# EAGLE design Power_Opamp (EAGLE 9.6.2)
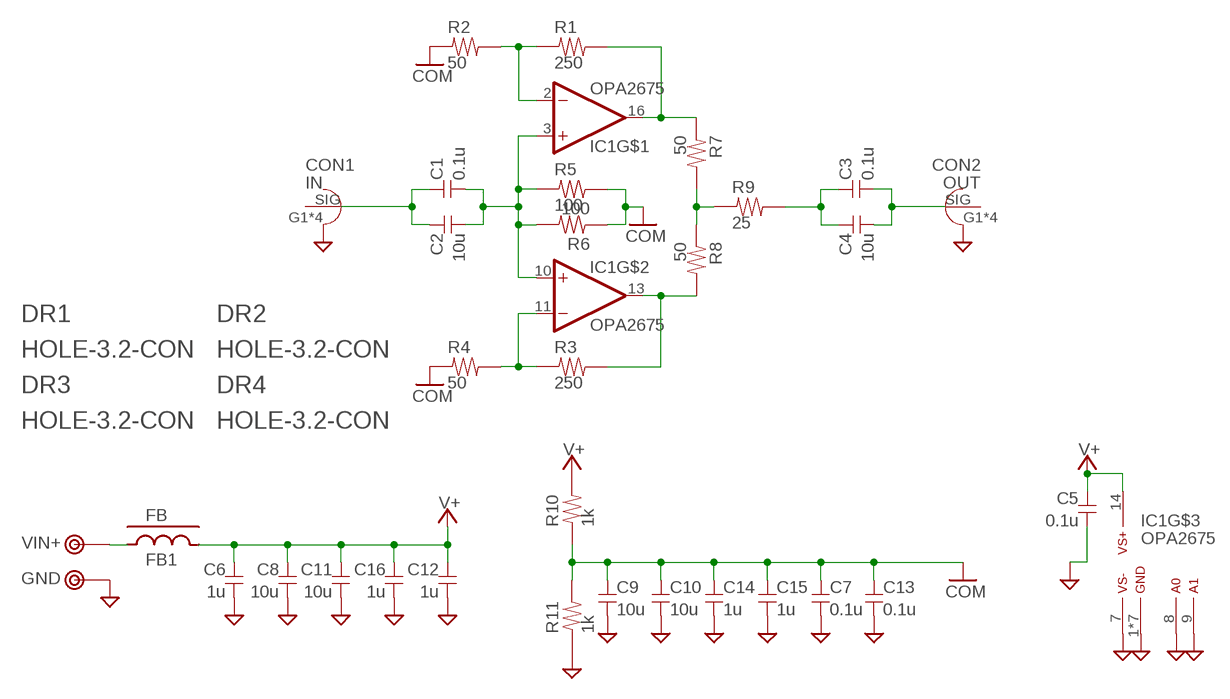
[diagram p0: schematic, sheet 1]

## Parts
C1  0.1u  C-1608  [1608C]
C2  10u  C-2012  [2012]
C3  0.1u  C-1608  [1608C]
C4  10u  C-2012  [2012]
C5  0.1u  C-1005  [1005]
C6  1u  C-1608  [1608C]
C7  0.1u  C-1005  [1005]
C8  10u  C-3216  [3216]
C9  10u  C-3216  [3216]
C10  10u  C-2012  [2012]
C11  10u  C-2012  [2012]
C12  1u  C-1608  [1608C]
C13  0.1u  C-1005  [1005]
C14  1u  C-1608  [1608C]
C15  1u  C-1608  [1608C]
C16  1u  C-1608  [1608C]
CON1  IN  SMA-142-0701-801  [SMA-EDGE]
CON2  OUT  SMA-142-0701-801  [SMA-EDGE]
DR1  HOLE-3.2-CON  [HOLE_3.2_CON]
DR2  HOLE-3.2-CON  [HOLE_3.2_CON]
DR3  HOLE-3.2-CON  [HOLE_3.2_CON]
DR4  HOLE-3.2-CON  [HOLE_3.2_CON]
FB1  FB  FB-2012  [2012-J]
IC1  OPA2675  [VQFN16]
R1  250  R-1608-3  [1608-3]
R2  50  R-1608-3  [1608-3]
R3  250  R-1608-3  [1608-3]
R4  50  R-1608-3  [1608-3]
R5  100  R-1608-3  [1608-3]
R6  100  R-1608-3  [1608-3]
R7  50  R-1608  [1608]
R8  50  R-1608  [1608]
R9  25  R-1608  [1608]
R10  1k  R-1608  [1608]
R11  1k  R-1608  [1608]
TP1  VIN+  TESTPIN-BIG  [TESTPIN-BIG]
TP2  GND  TESTPIN-BIG  [TESTPIN-BIG]

## Nets
AMP_IN: C1.2 C2.2 IC1.3(+IN) IC1.10(+IN) R5.1 R6.2
AMP_OUT: C3.1 C4.1 R9.2
COM: C7.1 C9.1 C10.1 C13.1 C14.1 C15.1 R2.1 R4.1 R5.2 R6.1 R10.1 R11.2
GND: C5.2 C6.2 C7.2 C8.2 C9.2 C10.2 C11.2 C12.2 C13.2 C14.2 C15.2 C16.2 CON1.G1(GND) CON1.G2(GND) CON1.G3(GND) CON1.G4(GND) CON2.G1(GND) CON2.G2(GND) CON2.G3(GND) CON2.G4(GND) IC1.1(GND) IC1.4(GND) IC1.5(GND) IC1.6(GND) IC1.7(VS-) IC1.8(A0) IC1.9(A1) IC1.12(GND) IC1.15(GND) IC1.HT(GND) R11.1 TP2.1
N$1: IC1.11(-IN) R3.1 R4.2
N$2: IC1.2(-IN) R1.1 R2.2
N$3: IC1.13(OUT) R3.2 R8.2
N$4: IC1.16(OUT) R1.2 R7.1
N$7: C1.1 C2.1 CON1.SIG
N$8: C3.2 C4.2 CON2.SIG
N$9: R7.2 R8.1 R9.1
N$10: FB1.2 TP1.1
V+: C5.1 C6.1 C8.1 C11.1 C12.1 C16.1 FB1.1 IC1.14(VS+) R10.2

## Library data of the parts
C1-C16 = my_rcl:C
CON1 CON2 = my_connector:SMA
DR1-DR4 = my_connector:HOLE-3.2
FB1 = my_rcl:FB
IC1 = my_ic:OPA2675
R1-R11 = my_rcl:R
TP1 TP2 = my_connector:TESTPIN

## Board
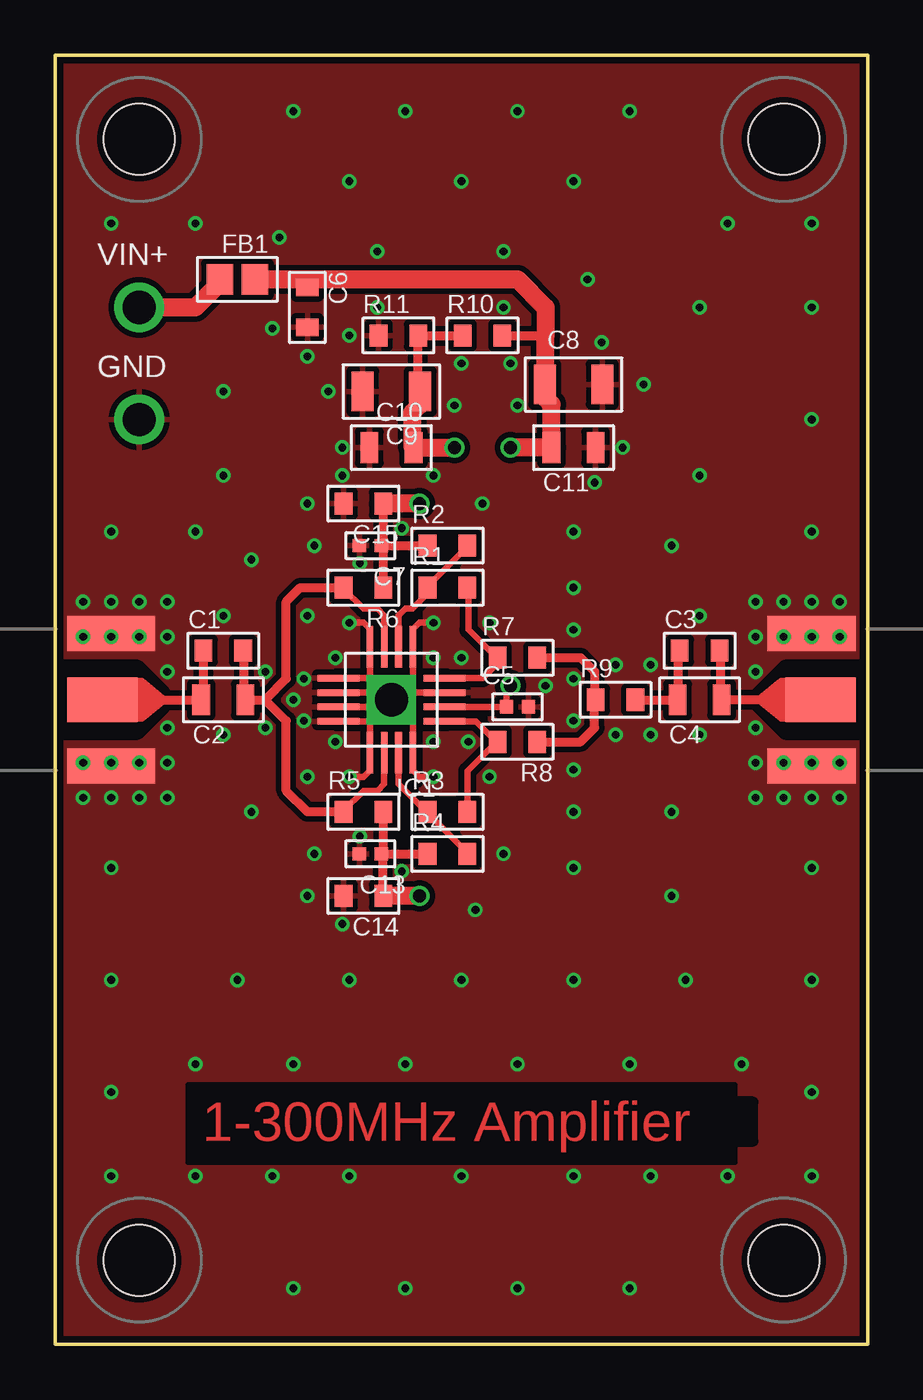
[diagram p1: board, top side]
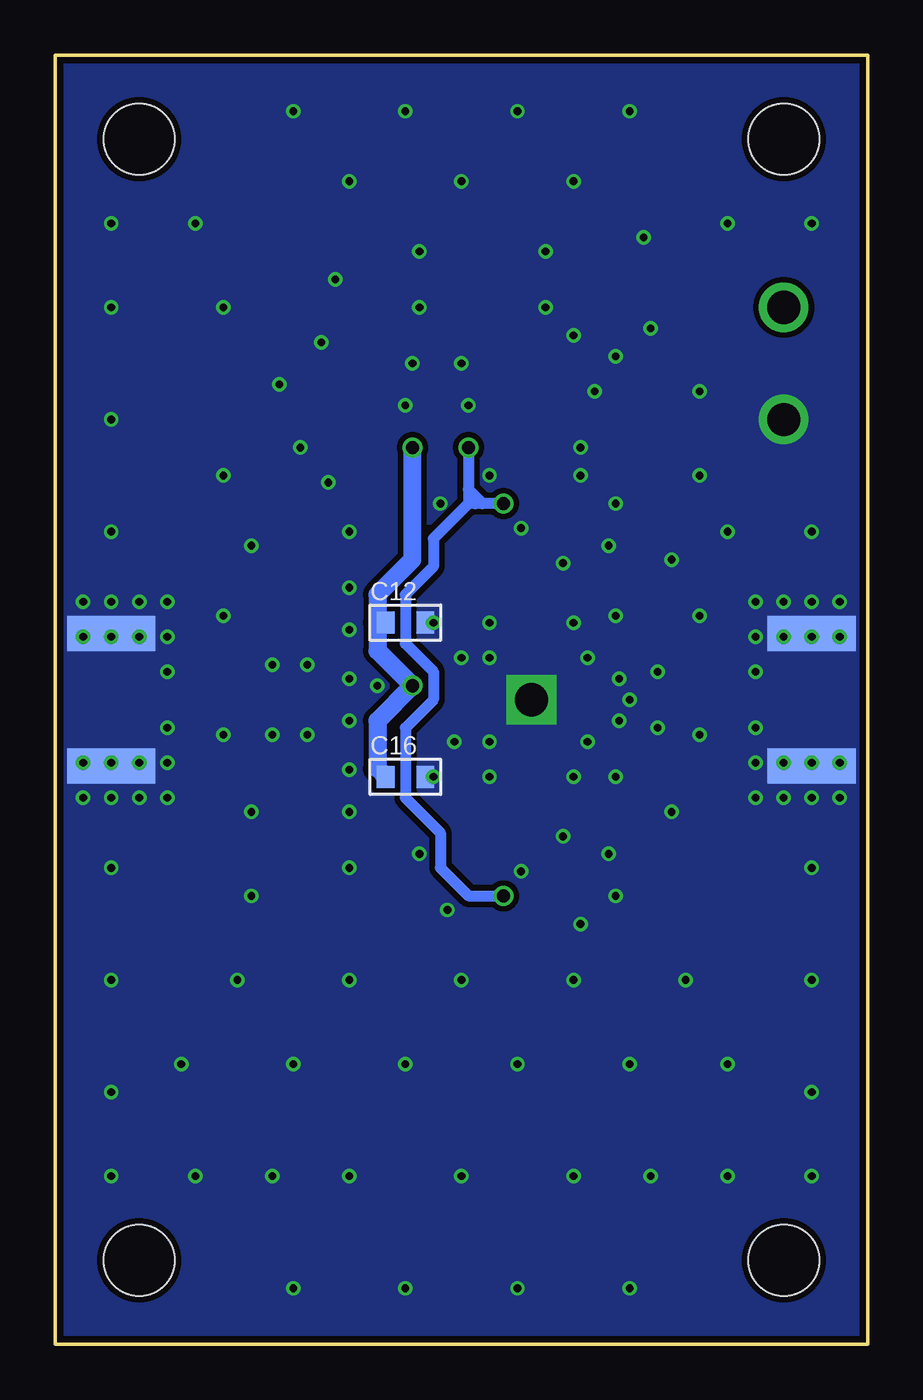
[diagram p2: board, bottom side, seen from below]

Size 36.83 x 58.42 mm. Coordinates in mm from the lower left corner, seen from the top.
Outline: 0,0 36.83,0 36.83,58.42 0,58.42 0,0
Copper layers (1*16): Top 0.035mm / dielectric 1.5mm / Bottom 0.035mm
Design rules "SeeedStudio_2layer_DRU_20140221": minimum track width 6mil, minimum drill 0.3mm, track to track 8mil, track to pad 8mil, pad to pad 8mil, via to via 12mil, smd to smd 0mil, copper to edge 0.3mm, drill to drill 10mil, minimum pad ring 0.15mm, minimum via ring 6mil, stop-mask expansion 2mil, vias tented up to drill 1mm, thermal gap 10mil

### Footprints (pad centres in the part's own frame; a part is rotated, then mirrored left to right if it is on the bottom)
1608C = smd 0.8 x 1: 1 -0.9,0; 2 0.9,0
2012 = smd 0.8 x 1.4: 1 -1,0; 2 1,0
1005 = smd 0.6 x 0.6: 1 -0.5,0; 2 0.5,0
3216 = smd 1 x 1.8: 1 -1.3,0; 2 1.3,0
SMA-EDGE = smd 1.6 x 4: G1 -3,0; G2 3,0 | smd 1.6 x 4 bottom: G3 -3,0; G4 3,0 | smd 2 x 3.2: SIG 0,0.4
HOLE_3.2_CON = hole 3.2: 0,0
2012-J = smd 1.2 x 1.4: 1 -0.8,0; 2 0.8,0
VQFN16 = smd 0.3 x 1.9: 1 -0.975,-2.4; 2 -0.325,-2.4; 3 0.325,-2.4; 4 0.975,-2.4; 9 0.975,2.4; 10 0.325,2.4; 11 -0.325,2.4; 12 -0.975,2.4 | smd 1.9 x 0.3: 5 2.4,-0.975; 6 2.4,-0.325; 7 2.4,0.325; 8 2.4,0.975; 13 -2.4,0.975; 14 -2.4,0.325; 15 -2.4,-0.325; 16 -2.4,-0.975 | drill 1.5 pad 2.2 square: HT 0,0
1608-3 = smd 0.8 x 1: 1 -0.9,0; 2 0.9,0
1608 = smd 0.8 x 1: 1 -0.9,0; 2 0.9,0
TESTPIN-BIG = drill 1.5: 1 0,0

### Placement (x,y rotation side)
C1  7.62,31.43 0 top
C2  7.62,29.21 0 top
C3  29.21,31.43 0 top
C4  29.21,29.21 0 top
C5  20.95,28.89 0 top
C6  11.43,46.99 270 top
C7  14.29,36.2 180 top
C8  23.5,43.5 0 top
C9  15.24,43.18 180 top
C10  15.24,40.64 180 top
C11  23.5,40.64 0 top
C12  20.95,32.7 0 bottom
C13  14.29,22.23 180 top
C14  13.97,20.32 180 top
C15  13.97,38.1 180 top
C16  20.95,25.72 0 bottom
CON1  2.54,29.21 90 top
CON2  34.29,29.21 270 top
DR1  3.81,3.81 0 top
DR2  33.02,3.81 0 top
DR3  3.81,54.61 0 top
DR4  33.02,54.61 0 top
FB1  8.26,48.26 180 top
IC1  15.24,29.21 180 top
R1  17.78,34.29 0 top
R2  17.78,36.2 0 top
R3  17.78,24.13 0 top
R4  17.78,22.23 0 top
R5  13.97,24.13 0 top
R6  13.97,34.29 180 top
R7  20.95,31.11 0 top
R8  20.95,27.3 180 top
R9  25.4,29.21 0 top
R10  19.37,45.72 0 top
R11  15.56,45.72 0 top
TP1  3.81,46.99 0 top
TP2  3.81,41.91 0 top

### Tracks (layer width: path | path; a pad name or v marks a point on that pad's centre or on a via)
AMP_IN
  Top 0.305: IC1.10 14.91,25.39 14.61,25.08 13.97,25.08 13.07,24.18 R5.1 | IC1.3 14.91,33.03 14.61,33.34 13.97,33.34 13.07,34.24 R6.2
  Top 0.406: R5.1 11.43,24.13 10.48,25.08 10.48,28.26 9.53,29.21 | R6.2 11.11,34.29 10.48,33.66 10.48,30.16 9.53,29.21 | 9.53,29.21 C2.2 8.57,29.26 8.57,31.38 C1.2
AMP_OUT
  Top 0.406: R9.2 C4.1 28.26,29.26 28.26,31.38 C3.1
COM  (via drill 0.6)
  Top 0.406: R6.1 14.87,36.11 C7.1 | C7.1 15.24,36.2 R2.1 | C15.1 14.87,36.28 C7.1 | R5.2 14.87,22.31 C13.1 | C13.1 R4.1 | C14.1 14.87,22.14 C13.1 | C9.1 16.46,43.26 R11.2 R10.1
  Top 0.813: v18.1,40.64 C10.1 16.19,40.69 16.19,42.23 16.54,42.58 C9.1 | v16.51,20.32 C14.1 | v16.51,38.1 C15.1
  Bottom 0.508: v16.51,38.1 17.46,38.1 | 17.46,38.1 17.78,38.1 18.1,38.1 | v16.51,20.32 18.1,20.32 19.37,21.59 19.37,23.18 20.95,24.77 20.95,27.94 19.68,29.21 19.68,30.48 20.95,31.75 20.95,33.97 19.68,35.24 19.68,36.51 18.1,38.1 | v18.1,40.64 18.1,38.73 | 18.1,38.73 18.1,38.1 | 17.46,38.1 18.1,38.73
GND  (via drill 0.35)
  Top 0.305: 14.27,28.23 IC1.9 14.27,26.01 13.97,25.72 v13.34,25.72 | 14.27,28.23 14.92,28.89 | 14.92,28.89 IC1.HT | IC1.8 14.27,28.23 | IC1.7 14.91,28.89 14.92,28.89 | IC1.6 14.91,29.54 | 14.91,29.54 IC1.HT | IC1.5 14.27,30.18 | 14.27,30.18 14.91,29.54 | 14.27,30.18 IC1.4 14.27,32.41 13.97,32.7 v13.34,32.7 | 15.56,29.53 16.21,30.18 IC1.1 16.21,32.41 16.51,32.7 v17.14,32.7 | 15.56,29.53 IC1.HT | IC1.15 15.56,29.54 15.56,29.53 | IC1.HT 16.21,28.23 IC1.12 16.21,26.01 16.51,25.72 v17.14,25.72
  other vias: 17.14,31.11 17.14,27.3 23.5,30.16 23.5,28.26 19.68,25.72 19.68,32.7 22.23,29.84 18.73,27.3 18.41,31.11 23.5,26.04 23.5,24.13 23.5,21.59 23.5,34.29 23.5,36.83 11.27,30.16 11.27,28.26 12.7,31.11 12.7,27.3 7.62,33.02 7.62,27.62 29.21,33.02 29.21,27.62 11.43,25.72 11.43,33.02 25.4,30.8 23.5,32.38 25.4,27.62 11.43,20.32 11.75,22.23 11.75,36.2 11.43,38.1 8.89,24.13 8.89,35.56 13.02,19.05 19.05,19.68 20.32,22.23 13.02,39.37 19.37,38.1 13.02,40.64 12.38,43.18 26.67,43.5 25.72,40.64 1.27,26.35 2.54,26.35 3.81,26.35 5.08,26.35 5.08,24.77 3.81,24.77 2.54,24.77 1.27,24.77 5.08,27.94 5.08,30.48 5.08,32.07 3.81,32.07 2.54,32.07 1.27,32.07 1.27,33.66 2.54,33.66 3.81,33.66 5.08,33.66 35.56,26.35 34.29,26.35 33.02,26.35 31.75,26.35 31.75,24.77 33.02,24.77 34.29,24.77 35.56,24.77 31.75,27.94 31.75,30.48 31.75,32.07 33.02,32.07 34.29,32.07 35.56,32.07 35.56,33.66 34.29,33.66 33.02,33.66 31.75,33.66 26.99,30.8 26.99,27.62 9.53,30.48 9.53,27.94 10.79,29.21 13.34,45.72 14.61,46.99 20.32,46.99 24.77,45.4 24.45,39.05 20.64,44.45 18.1,42.55 20.95,42.55 18.41,44.45 24.13,48.26 20.32,49.53 14.61,49.53 11.43,44.77 9.84,46.04 10.16,50.16 2.54,50.8 6.35,50.8 10.79,55.88 15.88,55.88 20.95,55.88 26.04,55.88 34.29,50.8 30.48,50.8 2.54,36.83 2.54,21.59 2.54,16.51 2.54,11.43 2.54,7.62 6.35,7.62 34.29,21.59 34.29,16.51 34.29,11.43 34.29,7.62 30.48,7.62 34.29,36.83 34.29,41.91 34.29,46.99 10.79,2.54 15.88,2.54 20.95,2.54 26.04,2.54 13.34,52.7 18.41,52.7 23.5,52.7 29.21,46.99 29.21,39.37 27.94,36.2 27.94,24.13 27.94,20.32 13.34,7.62 18.41,7.62 23.5,7.62 10.79,12.7 15.88,12.7 20.95,12.7 26.04,12.7 31.11,12.7 13.34,16.51 18.41,16.51 23.5,16.51 28.57,16.51 8.26,16.51 6.35,12.7 7.62,39.37 7.62,43.18 6.35,36.83 9.84,7.62 26.99,7.62 13.81,23.02 13.81,35.4 17.14,39.37 15.72,21.43 15.72,36.99
  pour Top (isolate 0.254): 0,58.42 0,0 36.83,0 36.83,58.42
  pour Bottom (isolate 0.254, no thermals): 0,0 36.83,0 36.83,58.42 0,58.42
  cutout Top (isolate 0.254): 12.7,30.48 12.7,27.94 13.97,27.94 13.97,25.4 16.51,25.4 16.51,27.94 17.78,27.94 17.78,30.48 16.51,30.48 16.51,33.02 13.97,33.02 13.97,30.48
  pour Top (isolate 0.254, no thermals): 36.83,34.29 31.75,34.29 31.75,24.13 36.83,24.13
  pour Top (isolate 0.254, no thermals): 5.08,34.29 0,34.29 0,24.13 5.08,24.13
  cutout Top (isolate 0.254, no thermals): 6.03,11.75 6.03,8.26 30.8,8.26 30.8,11.75
N$1
  Top 0.305: IC1.11 15.56,25.39 16.83,24.13 R3.1 16.88,24.08 18.68,22.28 R4.2
  Top 0.406: R3.1 16.88,24.08
N$2
  Top 0.305: IC1.2 15.56,33.03 15.88,33.34 16.19,33.34 16.88,34.02 R1.1 16.88,34.34 18.68,36.14 R2.2
  Top 0.406: 16.88,34.34 R1.1
N$3
  Top 0.305: IC1.13 19.07,28.23 20,27.3 | 20,27.3 R8.2 20,27.3 | R3.2 18.68,25.98 20,27.3
N$4
  Top 0.305: IC1.16 19.39,30.18 20.05,30.85 R7.1 20,31.11 18.73,32.38 18.73,34.24 R1.2
N$7
  Top 0.406: CON1.SIG C2.1 6.72,29.31 C1.1
N$8
  Top 0.406: C3.2 30.16,31.38 30.16,29.26 C4.2 CON2.SIG
N$9
  Top 0.406: R8.1 23.81,27.3 24.45,27.94 24.45,29.16 R9.1 24.45,29.26 24.45,30.48 23.81,31.11 R7.2
N$10
  Top 0.813: FB1.2 7.46,48.09 6.35,46.99 TP1.1
V+  (via drill 0.6)
  Top 0.305: IC1.14 C5.1 20.45,29.66 v20.64,29.84
  Top 0.406: R10.2 22.23,45.72
  Top 0.813: v20.64,40.64 C11.1 22.5,42.59 22.2,42.89 C8.1 22.23,43.53 22.23,45.72 22.23,46.99 20.95,48.26 11.43,48.26 | FB1.1 11.43,48.26 | C6.1 11.43,48.26
  Bottom 0.813: 22.23,32.7 22.23,33.97 20.64,35.56 v20.64,40.64 | 22.23,32.7 22.23,31.43 v20.64,29.84 22.23,28.26 22.23,26.09 C16.1 | C12.1 22.23,32.7

### Text on the board
Top: 1-300MHz Amplifier